# EAGLE design riffleito-REVF-routed (EAGLE 6.5.0)
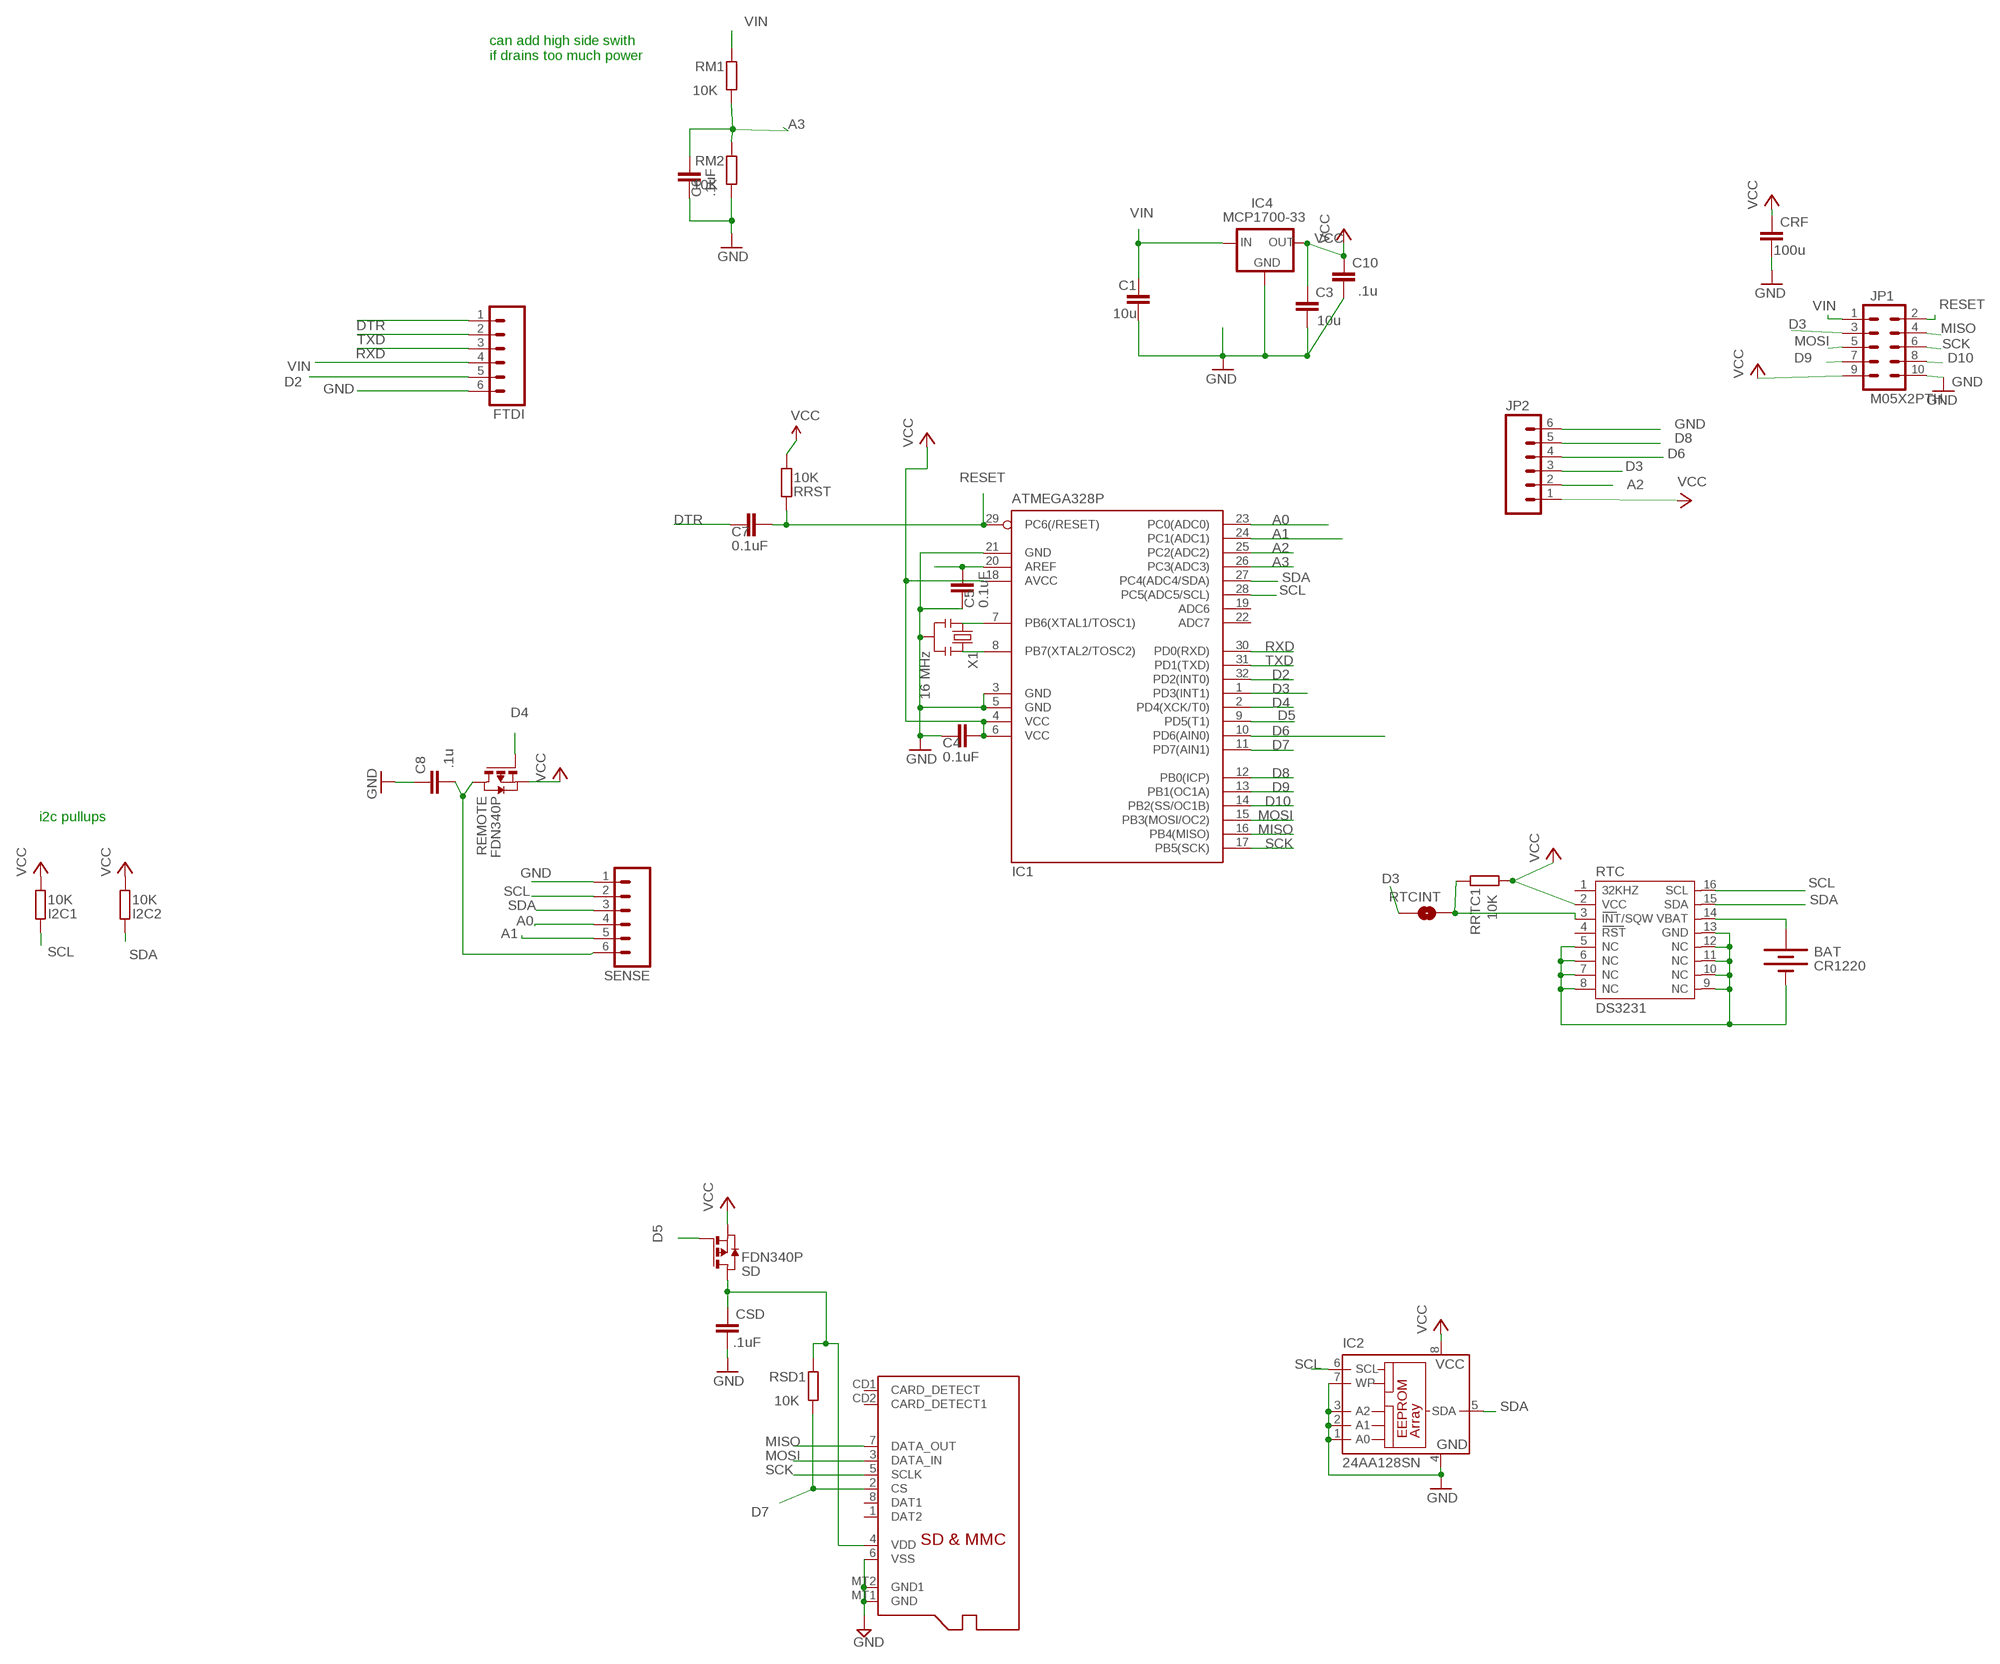
[diagram p0: schematic, sheet 1]

## Parts
BAT  CR1220  BATTERYBATTERY_12MM_SMT  [BATTCON_12MM_SMT]
C1  10u  C-EUC0805  [C0805]
C3  10u  C-EUC0805  [C0805]
C4  0.1uF  C-EUC0805  [C0805@1]
C5  0.1uF  C-EUC0805  [C0805@1]
C6  .1uF  C-EUC0805  [C0805@1]
C7  0.1uF  C-EUC0805  [C0805@1]
C8  .1u  C-EUC0805  [C0805]
C10  .1u  C-EUC0805  [C0805]
CRF  100u  C-EUC0805  [C0805]
CSD  .1uF  C-EUC0805  [C0805]
FTDI  M06SIP  [1X06]
I2C1  10K  R-EU_R0805  [R0805]
I2C2  10K  R-EU_R0805  [R0805]
IC1  ATMEGA328P  MEGA8-AI  [TQFP32-08]
IC2  24AA128SN  [SO-08]
IC4  MCP1700-33  MCP1700SOT233  [SOT23]
JP1  M05X2PTH  [AVR_ICSP]
JP2  M06LOCK  [1X06_LOCK]
MICROSD  MICROSD  [MICROSD]
REMOTE  FDN340P  PMOSSOT23  [SOT-23]
RM1  10K  R-EU_R0805  [R0805]
RM2  10K  R-EU_R0805  [R0805]
RRST  10K  R-EU_R0805  [R0805]
RRTC1  10K  R-EU_R0805  [R0805]
RSD1  10K  R-EU_R0805  [R0805]
RTC  DS3231  [DS3231]
RTCINT  SOLDERJUMPERNO  [SJ_2S-NO]
SD  FDN340P  PMOSSOT23  [SOT-23]
SENSE  M06SIP  [1X06]
X1  16 MHz  RESONATORSMD  [RESONATOR-SMD]

## Nets
A0: IC1.23(PC0(ADC0)) SENSE.4
A1: IC1.24(PC1(ADC1)) SENSE.5
A2: IC1.25(PC2(ADC2)) JP2.2
A3: C6.2 IC1.26(PC3(ADC3)) RM1.1 RM2.2
AREF: C5.2 IC1.20(AREF)
D2: FTDI.5 IC1.32(PD2(INT0))
D3: IC1.1(PD3(INT1)) JP1.3 JP2.3 RTCINT.2
D4: IC1.2(PD4(XCK/T0)) REMOTE.3(G)
D5: IC1.9(PD5(T1)) SD.3(G)
D6: IC1.10(PD6(AIN0)) JP2.4
D7: IC1.11(PD7(AIN1)) MICROSD.2(CS) RSD1.1
D8: IC1.12(PB0(ICP)) JP2.5
D9: IC1.13(PB1(OC1A)) JP1.7
D10: IC1.14(PB2(SS/OC1B)) JP1.8
DTR: C7.1 FTDI.1
GND: BAT.P$1(-) C1.2 C3.2 C4.1 C5.1 C6.1 C8.1 C10.2 CRF.2 CSD.2 FTDI.6 IC1.3(GND) IC1.5(GND) IC1.21(GND) IC2.1(A0) IC2.2(A1) IC2.3(A2) IC2.4(GND) IC2.7(WP) IC4.1(GND) JP1.10 JP2.6 MICROSD.6(VSS) MICROSD.MT1(GND) MICROSD.MT2(GND1) RM2.1 RTC.5(NC) RTC.6(NC) RTC.7(NC) RTC.8(NC) RTC.9(NC) RTC.10(NC) RTC.11(NC) RTC.12(NC) RTC.13(GND) SENSE.1 X1.2
MISO: IC1.16(PB4(MISO)) JP1.4 MICROSD.7(DATA_OUT)
MOSI: IC1.15(PB3(MOSI/OC2)) JP1.5 MICROSD.3(DATA_IN)
N$1: RRTC1.2 RTC.3(INT/SQW) RTCINT.1
N$2: IC1.8(PB7(XTAL2/TOSC2)) X1.3
N$3: IC1.7(PB6(XTAL1/TOSC1)) X1.1
RESET: C7.2 IC1.29(PC6(/RESET)) JP1.2 RRST.2
RTC_BATT: BAT.P$2(+) RTC.14(VBAT)
RXD: FTDI.3 IC1.30(PD0(RXD))
SCK: IC1.17(PB5(SCK)) JP1.6 MICROSD.5(SCLK)
SCL: I2C1.2 IC1.28(PC5(ADC5/SCL)) IC2.6(SCL) RTC.16(SCL) SENSE.2
SDA: I2C2.2 IC1.27(PC4(ADC4/SDA)) IC2.5(SDA) RTC.15(SDA) SENSE.3
TXD: FTDI.2 IC1.31(PD1(TXD))
VCC: C3.1 C4.2 C8.2 C10.1 CRF.1 I2C1.1 I2C2.1 IC1.4(VCC) IC1.6(VCC) IC1.18(AVCC) IC2.8(VCC) IC4.2(OUT) JP1.9 JP2.1 REMOTE.1(D) REMOTE.2(S) RRST.1 RRTC1.1 RTC.2(VCC) SD.2(S) SENSE.6
VDD: CSD.1 MICROSD.4(VDD) RSD1.2 SD.1(D)
VIN [power]: C1.1 FTDI.4 IC4.3(IN) JP1.1 RM1.2
Unconnected: IC1.19(ADC6) IC1.22(ADC7) MICROSD.1(DAT2) MICROSD.8(DAT1) MICROSD.CD1(CARD_DETECT) MICROSD.CD2(CARD_DETECT1) RTC.1(32KHZ) RTC.4(RST)

## Notes on the sheet
- can add high side swith
  if drains too much power
- i2c pullups

## Library data of the parts
BAT = SparkFunNew:BATTERY: Battery Holders Various common sizes : AA, AAA, 20mm coin cell and 12mm coin cell.
C1 C3 C8 C10 CRF CSD = resistor:C-EU: CAPACITOR, European symbol
C4-C7 = rcl:C-EU: CAPACITOR, European symbol
FTDI JP2 SENSE = SparkFun-Connectors:M06: Header 6 Standard 6-pin 0.1" header. Use with straight break away headers (SKU : PRT-00116), right angle break away headers (PRT-00553), swiss pins (PRT-00743), machine pins (PRT-00117), and female headers (PRT-00115). Molex polarized connector foot print use with SKU : PRT-08094 with associated crimp pins and housings. NOTES ON THE VARIANTS LOCK and LOCK_LONGPADS... This footprint was designed to help hold the alignment of a through-hole component (i.e. 6-pin header) while soldering it into place. You may notice that each hole has been shifted either up or down by 0.005 of an inch from it's more standard position (which is a perfectly straight line). This slight alteration caused the pins (the squares in the middle) to touch the edges of the holes. Because they are alternating, it causes a "brace" to hold the component in place. 0.005 has proven to be the perfect amount of "off-center" position when using our standard breakaway headers. Although looks a little odd when you look at the bare footprint, once you have a header in there, the alteration is very hard to notice. Also,if you push a header all the way into place, it is covered up entirely on the bottom side. This idea of altering the position of holes to aid alignment will be further integrated into the Sparkfun Library for other footprints. It can help hold any component with 3 or more connection pins.
I2C1 I2C2 RM1 RM2 RRST RRTC1 RSD1 = rcl:R-EU_: RESISTOR, European symbol
IC1 = atmel:MEGA8: MICROCONTROLLER 8 Kbytes FLASH, 1 kbytes SRAM, 512 bytes EEPROM, USART, 6-channel 10 bit ADC, 2-channel 8 bit ADC Pin compatible with Atmega48, ATMega88, ATMega168 Source: avr.lbr; MPN: ATMEGA8-16AU; OC_FARNELL: 9171371; OC_NEWARK: 73M8863
IC2 = microchip:24*: Serial EEPROM I2C; MF: MICROCHIP; MPN: 24AA128-I/SN; OC_FARNELL: unknown; OC_NEWARK: 92C6842
IC4 = adafruit:MCP1700: VOLTAGE REGULATOR
JP1 = SparkFun-Connectors:M05X2: Header 5x2 Standard 10-pin dual row 0.1" header. Commonly used with AVR-ISP. Use with Spark Fun Electronics SKU: PRT-00778
MICROSD = adafruit:MICROSD: Micro-SD / Transflash card holder with SPI pinout For the 3M # 2908-05WB-MG and/or 4UCON #19656 push-push type
REMOTE SD = zetex:PMOSSOT23: MOS FET
RTC = _lh-library:DS3231
RTCINT = _SparkFun:SOLDERJUMPER: Solder Jumper Standard SMD solder jumper. Used to automate production. Two varients : Normally Open and Normally Closed are the same, but have different paste layers. NC will have a large amount of paste and should jumper during reflow.
X1 = SparkFun:RESONATOR: Resonator Small SMD resonator. This is the itty bitty 10/20MHz resonators with built in caps. CSTCE10M0G55 and CSTCE20M0V53. Footprint has been reviewed closely but hasn't been tested yet.

## Net classes
0 default: width 0.203 mm, drill 0.33 mm, clearance 0.203 mm
1 power: width 0.381 mm, drill 0.33 mm, clearance 0.254 mm

## Board
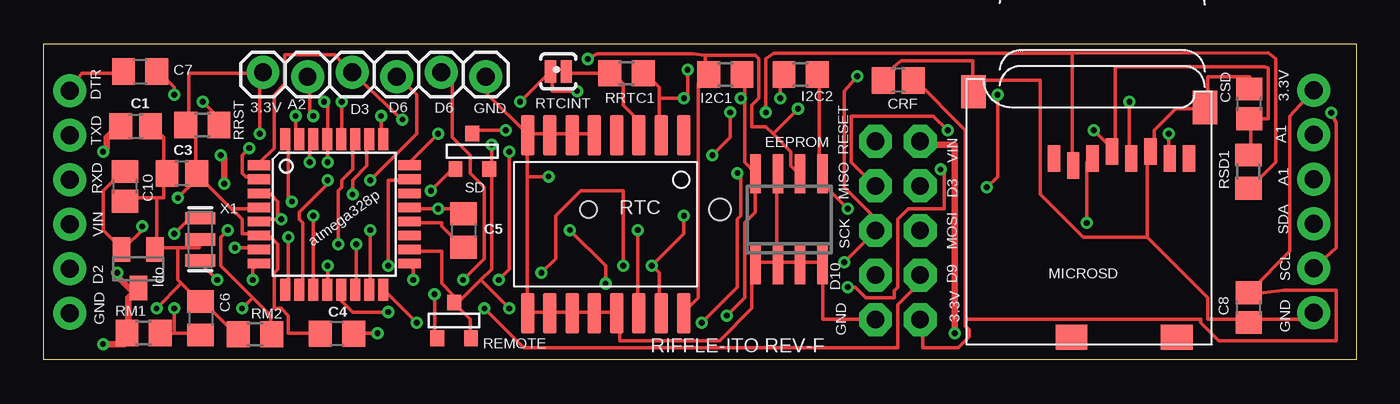
[diagram p1: board, top side]
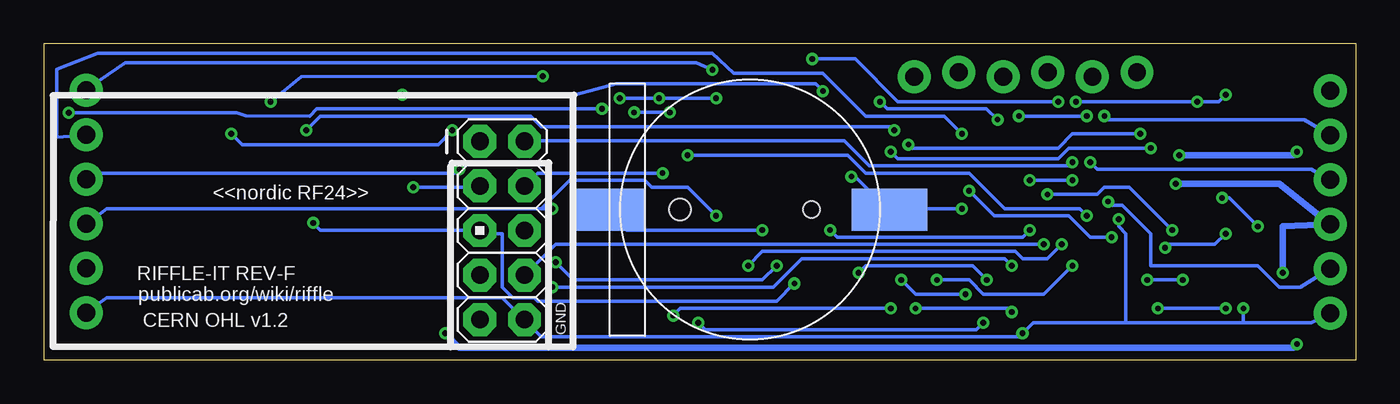
[diagram p2: board, bottom side, seen from below]

Size 74.83 x 18.01 mm. Coordinates in mm from the lower left corner, seen from the top.
Outline: 0,0 0,18.01 74.83,18.01 74.83,0 0,0
Copper layers (1*16): Top 0.0356mm / dielectric 1.5011mm / Bottom 0.0356mm
Design rules "LaenPCBOrder": minimum track width 6mil, minimum drill 13mil, track to track 6mil, track to pad 6mil, pad to pad 6mil, via to via 6mil, smd to smd 6mil, copper to edge 15mil, drill to drill 6mil, minimum pad ring 7mil, minimum via ring 7mil, stop-mask expansion 3mil, vias tented up to drill 0mil, thermal gap 10mil

### Footprints (pad centres in the part's own frame; a part is rotated, then mirrored left to right if it is on the bottom)
BATTCON_12MM_SMT = smd 2.4 x 4.3: P$1 0,11.96 | smd 2.4 x 4.2: P$2 0,-4.1 | hole 0.95: 0,7.5 | hole 1.25: 0,0
C0805 = smd 1.3 x 1.5: 1 -0.85,0; 2 0.85,0
C0805@1 = smd 1.3 x 1.5: 1 -0.95,0; 2 0.95,0
1X06 = drill 1.016 pad 1.88: 1 0,0; 2 2.54,0; 3 5.08,0; 4 7.62,0; 5 10.16,0; 6 12.7,0
R0805 = smd 1.3 x 1.5: 1 -0.95,0; 2 0.95,0
TQFP32-08 = smd 1.27 x 0.559: 1 -4.293,2.8; 2 -4.293,2; 3 -4.293,1.2; 4 -4.293,0.4; 5 -4.293,-0.4; 6 -4.293,-1.2; 7 -4.293,-2; 8 -4.293,-2.8; 17 4.293,-2.8; 18 4.293,-2; 19 4.293,-1.2; 20 4.293,-0.4; 21 4.293,0.4; 22 4.293,1.2; 23 4.293,2; 24 4.293,2.8 | smd 0.559 x 1.27: 9 -2.8,-4.293; 10 -2,-4.293; 11 -1.2,-4.293; 12 -0.4,-4.293; 13 0.4,-4.293; 14 1.2,-4.293; 15 2,-4.293; 16 2.8,-4.293; 25 2.8,4.293; 26 2,4.293; 27 1.2,4.293; 28 0.4,4.293; 29 -0.4,4.293; 30 -1.2,4.293; 31 -2,4.293; 32 -2.8,4.293
SO-08 = smd 0.6 x 2.2: 1 -1.905,-2.6; 2 -0.635,-2.6; 3 0.635,-2.6; 4 1.905,-2.6; 5 1.905,2.6; 6 0.635,2.6; 7 -0.635,2.6; 8 -1.905,2.6
SOT23 = smd 1 x 1.4: 1 -0.95,-1.1; 2 0.95,-1.1; 3 0,1.1
AVR_ICSP = drill 1.016 pad 1.88 octagon: 1 -1.27,5.08; 2 1.27,5.08; 3 -1.27,2.54; 4 1.27,2.54; 5 -1.27,0; 6 1.27,0; 7 -1.27,-2.54; 8 1.27,-2.54; 9 -1.27,-5.08; 10 1.27,-5.08
1X06_LOCK = drill 1.016 pad 1.88: 1 0,0; 2 2.54,-0.254; 3 5.08,0; 4 7.62,-0.254; 5 10.16,0; 6 12.7,-0.254
MICROSD = smd 0.7 x 1.5: 1 9,-10.64; 2 7.9,-10.24; 3 6.8,-10.64; 4 5.7,-11.04; 5 4.6,-10.64; 6 3.5,-11.04; 7 2.4,-10.64; 8 1.3,-10.64 | smd 1.8 x 1.4: CD1 2,-0.44; CD2 8,-0.44 | smd 1.4 x 1.9: MT1 0.4,-13.54; MT2 13.6,-14.44
SOT-23 = smd 0.787 x 0.889: 1 0.025,-1.016; 2 -0.94,1.016; 3 0.991,1.016
DS3231 = smd 0.762 x 2.286: 1 -4.445,-5.08; 2 -3.175,-5.08; 3 -1.905,-5.08; 4 -0.635,-5.08; 5 0.635,-5.08; 6 1.905,-5.08; 7 3.175,-5.08; 8 4.445,-5.08; 9 4.445,5.08; 10 3.175,5.08; 11 1.905,5.08; 12 0.635,5.08; 13 -0.635,5.08; 14 -1.905,5.08; 15 -3.175,5.08; 16 -4.445,5.08
SJ_2S-NO = smd 0.635 x 1.27: 1 -0.45,0; 2 0.45,0
RESONATOR-SMD = smd 0.7 x 1.7: 1 -1.2,0; 2 0,0; 3 1.2,0

### Placement (x,y rotation side)
BAT  38.56,8.56 270 bottom
C1  5.23,13.31 0 top
C3  7.87,10.62 180 top
C4  16.71,1.47 180 top
C5  23.93,7.37 270 top
C6  8.94,2.36 270 top
C7  5.49,16.43 0 top
C8  68.71,2.97 90 top
C10  4.62,9.88 270 top
CRF  48.72,15.93 180 top
CSD  68.73,14.58 90 top
FTDI  1.47,15.34 270 top
I2C1  38.86,16.26 180 top
I2C2  43.15,16.26 0 top
IC1  16.56,8.28 0 top
IC2  42.49,8 0 top
IC4  5.38,5.18 180 top
JP1  48.69,7.37 0 bottom
JP2  12.5,16.38 0 top
MICROSD  66.6,0.84 180 top
REMOTE  23.42,2.24 180 top
RM1  5.69,1.52 180 top
RM2  12.04,1.45 0 top
RRST  9.04,13.39 0 top
RRTC1  33.22,16.33 180 top
RSD1  68.68,10.72 90 top
RTC  32.03,7.72 180 top
RTCINT  29.34,16.43 180 top
SD  24.46,11.89 180 top
SENSE  72.42,2.67 90 top
X1  8.92,6.86 270 top

### Tracks (layer width: path | path; a pad name or v marks a point on that pad's centre or on a via)
A0  (via drill 0.33)
  Top 0.203: v19.63,5.36 19.63,10.24 20.85,10.24 IC1.23 | v45.85,4.14 46.25,4.14 46.86,3.53 48.49,3.53 48.49,3.94 48.69,4.14 48.69,8 49.3,8.61 51.33,8.61 51.33,10.64 v51.13,10.85
  Bottom 0.203: v19.63,5.36 20.04,5.77 31.62,5.77 33.25,4.14 v45.85,4.14 | v51.13,10.85 51.33,10.64 71.86,10.64 72.26,10.41 SENSE.4
A1  (via drill 0.33)
  Top 0.203: v22.48,12.88 20.85,11.25 IC1.24
  Bottom 0.203: v22.48,12.88 23.49,13.89 27.97,13.89 30.4,16.33 35.48,16.33 36.7,17.48 71.75,17.48 74.09,16.56 74.09,12.67 72.59,12.8 SENSE.5
A2  (via drill 0.33)
  Top 0.203: v19.23,13.89 19.23,12.67 IC1.25 | v15.37,13.89 15.16,14.1 15.16,16.13 JP2.2
  Bottom 0.203: v15.37,13.89 v19.23,13.89
A3  (via drill 0.33)
  Top 0.203: 7.44,1.5 8.86,1.5 C6.2 | 7.44,1.5 6.83,1.5 RM1.1 | v17.6,9.42 17.6,10.24 18.41,11.05 18.41,12.47 IC1.26 | v10.49,7.39 10.08,6.99 10.08,5.36 11.91,3.53 | 11.91,3.53 12.93,2.51 12.93,1.5 RM2.2 | v7.44,2.92 7.44,1.5 | 11.91,3.53 v11.3,2.92
  Bottom 0.203: v17.6,9.42 14.76,9.42 14.35,9.83 12.93,9.83 v10.49,7.39 | v11.3,2.92 v7.44,2.92
AREF
  Top 0.203: IC1.20 20.85,7.8 22.68,7.8 22.68,7.59 23.9,6.38 C5.2
D2  (via drill 0.33)
  Top 0.203: v14.15,9.02 13.94,9.22 13.94,12.47 IC1.32
  Bottom 0.203: v14.15,9.02 13.94,8.81 13.33,8.81 11.71,7.19 11.71,5.36 5.61,5.36 4.39,4.14 3.17,4.14 2.06,4.85 FTDI.5
D3  (via drill 0.33)
  Top 0.203: IC1.1 12.32,11.25 13.13,12.07 13.13,15.11 13.74,15.72 13.74,17.4 16.59,17.4 17.4,16.54 JP2.3 17.55,16.38 v20.45,13.69 | v27.15,14.71 28.78,16.33 RTCINT.2 28.98,16.33 28.98,15.32 v30.4,15.32 | v53.77,9.83 54.38,10.44 v54.38,15.11
  Bottom 0.203: v27.15,14.71 26.75,14.3 21.08,14.3 v20.45,13.69 | v53.77,9.83 50.11,9.83 JP1.3 | v54.38,15.11 44.53,15.11 42.19,15.72 30.81,15.72 v30.4,15.32
D4  (via drill 0.33)
  Top 0.203: v22.28,3.73 22.28,1.3 REMOTE.3 | v25.93,4.55 26.54,5.16 v26.54,11.86 | v11.71,12.07 11.3,11.66 11.3,10.64 11.51,10.44 12.12,10.44 IC1.2
  Bottom 0.203: v22.28,3.73 25.12,3.73 v25.93,4.55 | v26.54,11.86 26.14,11.46 16.99,11.46 16.38,12.07 v11.71,12.07
D5  (via drill 0.33)
  Top 0.203: v22.07,9.63 23.29,10.85 SD.3 | v13.94,6.99 13.94,4.14 IC1.9
  Bottom 0.203: v22.07,9.63 20.65,8.2 16.38,8.2 15.16,6.99 v13.94,6.99
D6  (via drill 0.33)
  Top 0.203: v16.18,10.24 16.18,10.03 14.55,8.41 14.55,8 14.76,7.8 14.76,4.14 IC1.10 | v18.62,10.24 21.26,12.88 21.26,15.11 20.24,16.13 JP2.4
  Bottom 0.203: v18.62,10.24 v16.18,10.24
D7  (via drill 0.33)
  Top 0.203: v15.37,8.2 15.37,4.14 IC1.11 | v38.13,11.66 39.14,12.67 v39.14,14.1 | v41.17,14.1 41.17,17.15 41.6,17.48 58.65,17.48 | 58.65,17.48 58.65,11.25 MICROSD.2 | 58.65,17.48 69.82,17.5 70.23,17.15 70.23,11.25 68.81,9.83 RSD1.1
  Bottom 0.203: v15.37,8.2 15.77,8.61 20.04,8.61 22.07,10.64 27.97,10.64 28.98,11.66 v38.13,11.66 | v41.17,14.1 v39.14,14.1
D8  (via drill 0.33)
  Top 0.203: v16.18,5.36 16.18,4.14 IC1.12 | v23.9,4.55 25.12,5.77 25.12,9.83 24.31,10.64 24.31,11.66 23.29,12.67 23.29,15.72 22.68,16.33 JP2.5
  Bottom 0.203: v16.18,5.36 17.81,3.73 21.26,3.73 22.07,4.55 v23.9,4.55
D9  (via drill 0.33)
  Top 0.203: v19.63,2.72 17.6,2.72 16.99,3.33 16.99,3.94 IC1.13 | v25.12,2.92 27.36,0.69 48.69,0.69 48.69,3.12 49.91,4.34 49.91,4.75 JP1.7
  Bottom 0.203: v19.63,2.72 19.84,2.92 v25.12,2.92
D10  (via drill 0.33)
  Top 0.203: v17.81,6.58 17.81,4.14 IC1.14
  Bottom 0.203: v17.81,6.58 45.64,6.58 47.27,4.95 JP1.8
DTR
  Top 0.203: C7.1 4.39,16.33 2.16,16.33 1.73,15.7 FTDI.1
GND  (via drill 0.33)
  Top 0.203: SENSE.1 71.81,2.31 68.81,2.31 C8.1 68.61,2.31 66.37,2.31 66.37,3.53 62.92,6.99 | 52.96,15.93 52.96,15.32 MICROSD.MT2 52.96,15.93 | 52.96,15.93 52.96,17.04 48.89,17.04 48.49,16.74 48.49,16.54 47.88,15.93 CRF.2 | CSD.2 68.76,16.13 66.37,16.13 66.37,14.5 MICROSD.MT1 66.17,14.3 64.54,14.3 63.32,13.08 63.32,12.27 63.12,12.07 MICROSD.6 62.92,11.86 62.92,6.99 | 52.96,15.93 56.82,15.93 56.82,9.42 59.26,6.99 62.92,6.99 | RM2.1 10.9,1.5 9.07,3.33 C6.1 8.86,3.33 7.85,4.34 | 7.65,6.38 8.86,6.38 8.86,6.78 X1.2 | 7.65,6.38 6.43,6.38 | 6.43,9.22 6.83,9.22 6.83,10.44 C3.2 6.83,10.64 6.83,12.67 6.22,13.28 C1.2 | 6.43,9.22 4.8,9.22 C10.2 | 6.43,9.22 6.43,6.38 | 6.43,6.38 IC4.1 | 7.85,4.34 7.65,4.55 7.65,6.38 | 13.33,8 12.32,8 IC1.5 | 13.33,8 13.33,9.02 12.93,9.42 12.32,9.42 IC1.3 | v19.02,1.5 17.81,1.5 C4.1 | v13.54,8 13.33,8 | v6.43,2.92 7.85,4.34 | IC2.4 44.22,5.56 43.21,5.56 IC2.3 43,5.56 41.99,5.56 IC2.2 41.78,5.56 | 44.42,5.56 IC2.4 | 41.78,5.56 40.77,5.56 IC2.1 40.56,5.36 40.36,5.16 40.36,2.92 38.53,1.09 32.84,1.09 32.84,2.51 RTC.13 32.64,2.72 31.42,2.72 RTC.12 31.22,2.72 30.2,2.72 RTC.11 30,2.72 28.98,2.72 RTC.10 28.78,2.72 27.76,2.72 RTC.9 27.56,2.72 27.56,10.44 | 41.78,5.56 41.78,10.44 IC2.7 | JP1.10 47.27,2.31 44.42,2.31 44.42,5.36 IC2.4 | 20.85,8.81 IC1.21 20.85,8.61 v22.48,8.61 23.9,8.61 23.9,8.41 C5.1 | RTC.8 27.76,12.88 28.78,12.88 RTC.7 28.98,12.88 30,12.88 RTC.6 30.2,12.88 31.22,12.88 RTC.5 | RTC.8 27.56,12.88 25.32,15.11 25.32,16.13 JP2.6 | 27.56,10.44 27.56,12.67 RTC.8 | 27.56,10.44 v28.78,10.44
  Bottom 0.203: 6.43,2.11 2.57,2.11 2.11,2.34 FTDI.6 | 6.43,2.11 13.13,2.11 | 13.13,2.11 18.41,2.11 v19.02,1.5 19.23,1.3 46.46,1.3 47.27,2.11 JP1.10 47.47,2.31 48.69,3.53 71.25,3.53 72.42,2.69 SENSE.1 | v13.54,8 13.54,7.59 13.13,7.19 13.13,2.11 | 6.43,2.11 v6.43,2.92 | v22.48,8.61 26.54,8.61 BAT.P$1 26.75,8.61 28.57,10.44 v28.78,10.44
MISO  (via drill 0.33)
  Top 0.203: v21.26,2.11 19.43,3.94 IC1.16 | v37.52,2.11 39.55,4.14 39.55,8 39.75,8.2 39.75,10.44 v39.55,10.64 | v64.13,12.88 64.13,11.66 MICROSD.7 | v51.54,13.08 50.72,13.89 46.05,13.89 46.05,11.25 47.27,10.03 JP1.4
  Bottom 0.203: v21.26,2.11 21.67,1.7 37.11,1.7 v37.52,2.11 | v39.55,10.64 46.66,10.64 47.27,10.03 JP1.4 | v64.13,12.88 63.53,12.27 52.35,12.27 v51.54,13.08
MOSI  (via drill 0.33)
  Top 0.203: v18.62,7.39 18.62,4.14 IC1.15 | v30,7.39 32.03,5.36 v32.03,4.34 | v59.46,7.8 59.46,11.25 59.66,11.46 MICROSD.3
  Bottom 0.203: v18.62,7.39 19.02,6.99 29.59,6.99 v30,7.39 | v32.03,4.34 33.05,3.33 46.66,3.33 46.86,3.53 48.08,3.53 48.69,4.14 48.69,7.19 49.91,7.19 JP1.5 50.11,7.39 59.05,7.39 v59.46,7.8
N$1
  Top 0.203: RTCINT.1 29.79,16.33 RRTC1.2 32.44,16.33 33.05,15.72 33.05,14.5 33.86,13.69 33.86,12.88 RTC.3
N$2  (via drill 0.33)
  Top 0.203: v11.91,4.55 11.91,5.16 12.12,5.36 IC1.8 | v9.88,4.55 9.07,5.36 9.07,5.56 X1.3
  Bottom 0.203: v9.88,4.55 v11.91,4.55
N$3  (via drill 0.33)
  Top 0.203: v10.9,6.38 12.12,6.38 IC1.7 | v7.44,7.19 8.25,8 8.86,8 X1.1
  Bottom 0.203: v10.9,6.38 10.69,6.58 8.05,6.58 v7.44,7.19
RESET  (via drill 0.33)
  Top 0.203: v7.44,15.11 7.44,15.52 6.63,16.33 C7.2 | v9.07,14.71 9.88,13.89 9.88,13.49 RRST.2 | v16.18,11.25 16.18,12.47 IC1.29 16.18,12.67 16.18,14.5 v15.98,14.71
  Bottom 0.203: v7.44,15.11 7.85,14.71 v9.07,14.71 v15.98,14.71 | v16.18,11.25 16.38,11.05 27.76,11.05 29.18,12.47 47.27,12.47 JP1.2
RTC_BATT  (via drill 0.33)
  Top 0.203: v33.86,7.39 33.86,2.72 RTC.14
  Bottom 0.203: v33.86,7.39 41.58,7.39 42.6,8.41 BAT.P$2
RXD  (via drill 0.33)
  Top 0.203: v15.16,11.25 15.16,12.47 IC1.30
  Bottom 0.203: v15.16,11.25 14.76,10.85 2.57,10.85 2.08,10.57 FTDI.3
SCK  (via drill 0.33)
  Top 0.203: v21.06,4.55 21.06,5.16 20.85,5.36 IC1.17 | v28.37,4.95 29.18,5.77 29.18,8.2 30.61,9.63 33.05,9.63 v33.05,5.36 | v45.64,5.56 47.27,7.19 JP1.6 47.27,7.39 47.27,8.2 45.64,9.83 45.64,15.32 v46.38,16.15 | v61.9,14.71 61.9,11.66 MICROSD.5
  Bottom 0.203: v21.06,4.55 21.87,5.36 27.97,5.36 v28.37,4.95 | v33.05,5.36 33.86,4.55 44.63,4.55 v45.64,5.56 | v61.9,14.71 60.15,16.13 v46.38,16.15
SCL  (via drill 0.33)
  Top 0.203: v16.99,14.71 16.99,12.67 IC1.28 | v31.01,17.15 31.55,17.45 36.98,17.45 37.72,17.35 | 37.72,17.35 37.72,16.33 I2C1.2 37.72,16.13 37.31,15.72 37.31,3.53 36.5,2.72 RTC.16 | 41.58,12.88 41.17,13.28 40.36,13.28 40.36,14.5 40.77,14.91 40.77,17.15 40.56,17.35 37.72,17.35 | 41.58,12.88 42.6,11.86 42.6,11.05 43,10.64 IC2.6 | v73.41,14.07 73.69,13.49 73.69,6.38 72.47,5.26 SENSE.2 | 41.58,12.88 v43,14.3
  Bottom 0.203: v16.99,14.71 26.14,14.71 28.57,17.15 v31.01,17.15 | v73.41,14.07 63.83,14.07 63.32,13.92 59.66,13.89 59.26,14.3 v43,14.3
SDA  (via drill 0.33)
  Top 0.203: v16.79,6.58 16.79,9.63 16.99,9.83 16.99,10.24 17.6,10.85 17.6,12.47 IC1.27 | RTC.15 35.08,2.72 35.08,4.95 v34.67,5.36 36.5,7.19 v36.5,8.2 | I2C2.2 44.22,16.13 44.22,10.64 IC2.5 44.42,10.44 44.42,10.03 v45.85,8.61
  Bottom 0.203: v16.79,6.58 17.6,5.77 19.02,5.77 19.43,6.17 33.86,6.17 v34.67,5.36 | v45.85,8.61 46.46,8.61 | 46.46,8.61 71.25,8.61 72.36,7.77 SENSE.3 | v36.5,8.2 38.13,9.83 40.16,9.83 40.56,10.24 44.83,10.24 46.46,8.61
TXD  (via drill 0.33)
  Top 0.203: v14.35,13.89 14.35,12.88 14.55,12.67 IC1.31
  Bottom 0.203: v14.35,13.89 14.15,13.69 2.97,13.69 2.13,13.18 FTDI.2
VCC  (via drill 0.33)
  Top 0.203: 23.49,3.12 24.31,2.31 24.31,1.3 REMOTE.2 | 23.49,3.12 24.92,4.55 | 24.92,4.55 25.53,5.16 25.53,10.85 SD.2 25.53,11.05 v25.53,12.27 | 23.49,3.12 REMOTE.1 23.29,3.33 23.29,3.73 22.68,4.34 22.68,6.17 20.85,6.17 IC1.18 | C10.1 4.6,10.85 3.38,9.63 3.38,7.39 4.39,6.38 IC4.2 4.6,6.38 5.61,7.39 v5.61,7.59 | 10.69,8.61 8.86,10.44 C3.1 | 10.69,8.61 11.3,8 11.3,7.19 12.12,7.19 IC1.6 12.32,6.99 12.93,6.99 13.33,6.58 13.33,5.16 13.13,4.95 13.13,2.92 13.54,2.92 13.94,2.51 13.94,1.5 15.57,1.5 C4.2 | 10.69,8.61 12.12,8.61 IC1.4 | C3.1 8.66,10.64 8.66,12.88 8.25,13.28 RRST.1 8.25,13.49 8.25,16.33 12.32,16.33 | v7.65,9.22 8.66,10.24 8.66,10.44 C3.1 | 12.32,16.33 v12.32,12.88 | 12.32,16.33 JP2.1 | 52.55,2.31 52.55,1.91 52.76,1.7 52.76,1.3 52.15,0.69 50.11,0.69 50.11,2.11 JP1.9 | 52.55,2.31 52.55,13.08 49.71,15.93 CRF.1 | 35.08,14.91 35.08,12.88 RTC.2 | 35.08,14.91 35.08,15.52 34.26,16.33 RRTC1.1 | 39.95,14.91 39.95,11.25 40.56,10.64 IC2.8 40.56,10.44 40.56,8.41 39.95,7.8 39.95,3.53 v38.94,2.51 | 39.95,14.91 39.95,16.13 I2C1.1 | v41.99,14.91 41.99,15.93 42.19,16.13 I2C2.1 | 39.95,14.91 v39.75,14.91 | 35.08,14.91 v36.5,14.91 36.7,15.11 v36.7,16.54 | SENSE.6 72.24,15.19 71.04,13.89 71.04,6.17 68.81,3.94 C8.2 68.81,3.73 70.71,3.96 73.69,3.96 73.69,1.09 66.98,1.09 65.96,2.11 65.96,2.31 52.55,2.31 | v26.54,2.92 24.92,4.55
  Bottom 0.203: v5.61,7.59 7.24,9.22 v7.65,9.22 | v25.53,12.27 25.32,12.07 16.99,12.07 16.18,12.88 v12.32,12.88 | v41.99,14.91 v39.75,14.91 v36.5,14.91 | v36.7,16.54 37.62,16.94 70.18,16.94 72.19,15.57 SENSE.6 | v26.54,2.92 38.53,2.92 v38.94,2.51
VDD  (via drill 0.33)
  Top 0.203: 68.81,13.74 68.81,14.3 CSD.1 68.81,13.74 | 68.81,13.74 68.81,11.86 RSD1.2 | v26.34,13.08 24.51,13.08 SD.1 | v59.87,13.08 60.88,12.07 MICROSD.4 61.09,12.07 61.09,16.71 69.62,16.71 69.82,16.61 69.82,13.74 68.81,13.74
  Bottom 0.203: v26.34,13.08 26.54,13.28 46.46,13.28 47.07,13.89 59.05,13.89 v59.87,13.08
VIN  (via drill 0.33)
  Top 0.381: v3.38,11.86 3.58,12.07 3.58,12.67 4.19,13.28 C1.1 | v10.08,11.66 10.29,11.46 v10.29,10.03 | v4.19,4.95 4.19,4.75 5,3.94 IC4.3 5.21,3.94 4.8,3.53 4.8,1.7 RM1.2 4.6,1.5 4.6,0.89 v3.38,0.89 | v51.94,1.5 51.94,12.27 50.11,12.27 JP1.1
  Bottom 0.381: v3.38,11.86 3.58,11.66 v10.08,11.66 | v10.29,10.03 4.39,10.03 1.68,7.87 FTDI.4 2.11,7.7 4.19,7.59 v4.19,4.95 | v51.94,1.5 51.13,0.69 3.58,0.69 v3.38,0.89

### Text on the board
tPlace: 3.3V | DTR | 3.3V | D3 | D6 | D6 | A2 | GND | RESET | VIN | A1 | TXD | EEPROM | MISO | A1 | atmega328p | D3 | RXD | SDA | SCK | MOSI | VIN | SCL | ldo | D10 | D9 | D2 | 3.3V | GND | GND | GND | RIFFLE-ITO REV-F
bPlace: <<nordic RF24>> | RIFFLE-IT REV-F | GND | publicab.org/wiki/riffle | CERN OHL v1.2